# Altium schematic sheet MIPI_CSI.SchDoc: MIPI CSI CAM
size A4; DrawnBy: ThanhQuoc; Revision: V01; SheetNumber: 17; SheetTotal: 21; Project: RV1126 CAMERA BOARD DESIGN
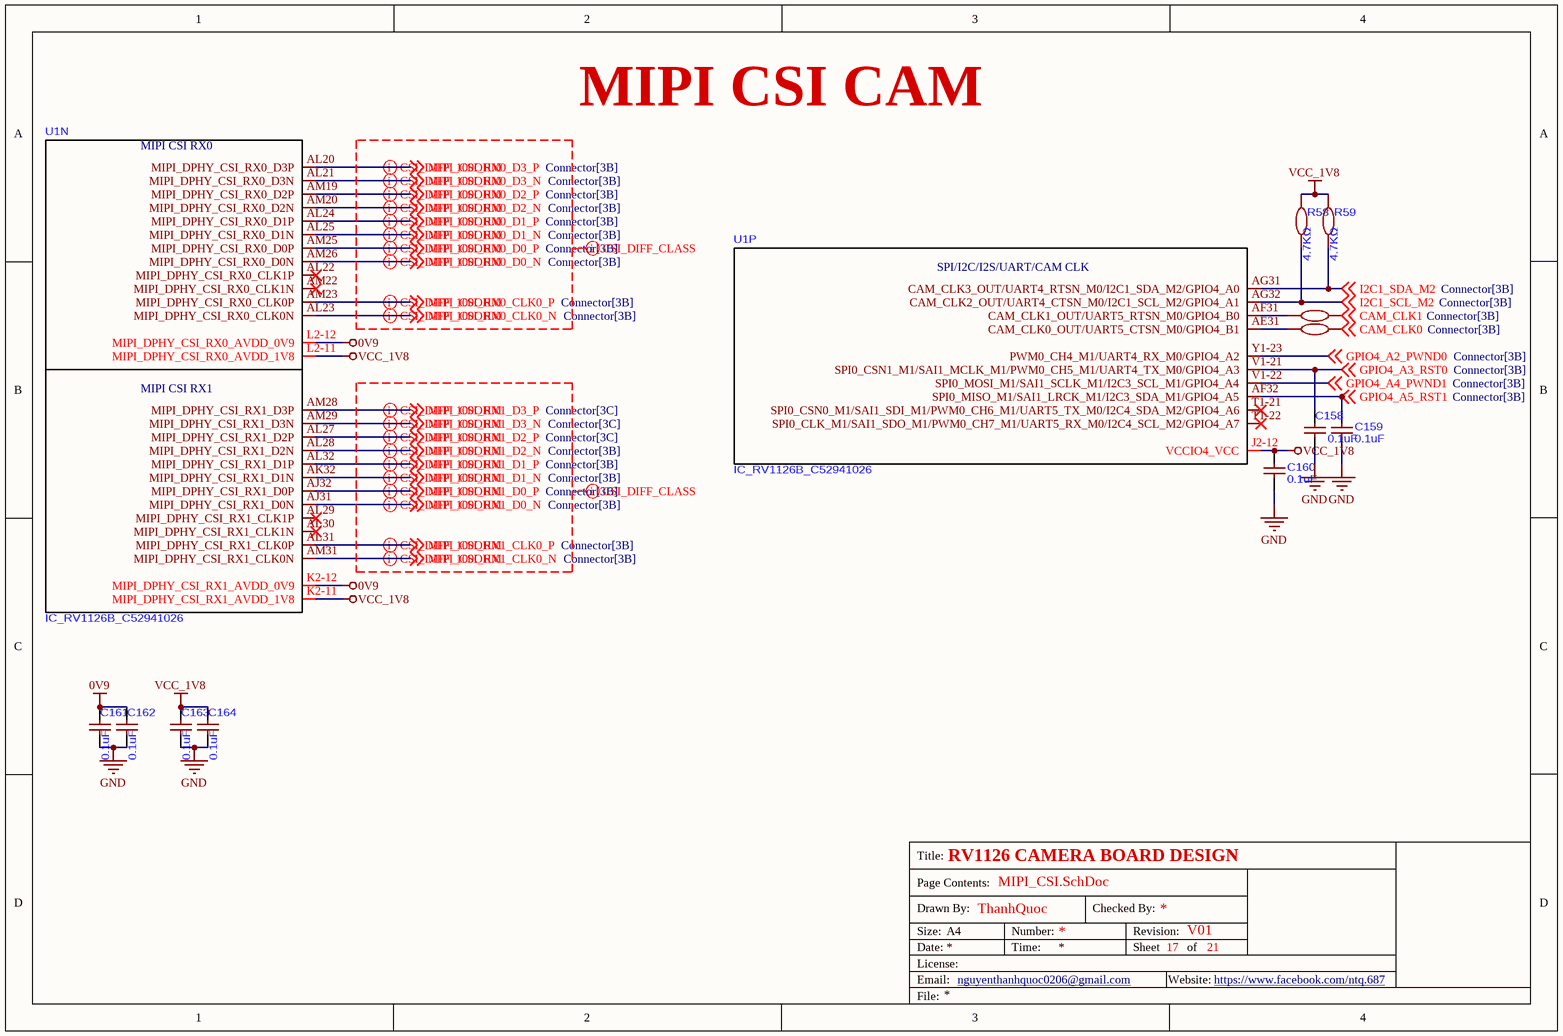
[diagram p0: MIPI_CSI.SchDoc]

## Parts
C158  0.1uF  [C0201]
C159  0.1uF  [C0201]
C160  0.1uF  [C0201]
C161  0.1uF  [C0201]
C162  0.1uF  [C0201]
C163  0.1uF  [C0201]
C164  0.1uF  [C0201]
R58  4.7KΩ  [R0201]
R59  4.7KΩ  [R0201]
R60  22Ω  [R0201]  (value not drawn)
R61  22Ω  [R0201]  (value not drawn)
U1  IC_RV1126B_C52941026  [CCSP-491_L14.0-W14.0-TL_RV1126B]  (parts N,P of 18)

## Nets
0V9: C161.2 C162.2 U1.K2-12(MIPI_DPHY_CSI_RX1_AVDD_0V9) U1.L2-12(MIPI_DPHY_CSI_RX0_AVDD_0V9)
GND: C158.1 C159.1 C160.1 C161.1 C162.1 C163.1 C164.1
VCC_1V8: C160.2 C163.2 C164.2 R58.2 R59.2 U1.J2-12(VCCIO4_VCC) U1.K2-11(MIPI_DPHY_CSI_RX1_AVDD_1V8) U1.L2-11(MIPI_DPHY_CSI_RX0_AVDD_1V8)
CAM_CLK0: R61.2 ; off-sheet CAM_CLK0
CAM_CLK1: R60.2 ; off-sheet CAM_CLK1
GPIO4_A2_PWND0: U1.Y1-23(PWM0_CH4_M1/UART4_RX_M0/GPIO4_A2) ; off-sheet GPIO4_A2_PWND0
GPIO4_A3_RST0: C158.2 U1.V1-21(SPI0_CSN1_M1/SAI1_MCLK_M1/PWM0_CH5_M1/UART4_TX_M0/GPIO4_A3) ; off-sheet GPIO4_A3_RST0
GPIO4_A4_PWND1: U1.V1-22(SPI0_MOSI_M1/SAI1_SCLK_M1/I2C3_SCL_M1/GPIO4_A4) ; off-sheet GPIO4_A4_PWND1
GPIO4_A5_RST1: C159.2 U1.AF32(SPI0_MISO_M1/SAI1_LRCK_M1/I2C3_SDA_M1/GPIO4_A5) ; off-sheet GPIO4_A5_RST1
I2C1_SCL_M2: R58.1 U1.AG32(CAM_CLK2_OUT/UART4_CTSN_M0/I2C1_SCL_M2/GPIO4_A1) ; off-sheet I2C1_SCL_M2
I2C1_SDA_M2: R59.1 U1.AG31(CAM_CLK3_OUT/UART4_RTSN_M0/I2C1_SDA_M2/GPIO4_A0) ; off-sheet I2C1_SDA_M2
MIPI_CSI_RX0_CLK0_N: U1.AL23(MIPI_DPHY_CSI_RX0_CLK0N) ; off-sheet MIPI_CSI_RX0_CLK0_N
MIPI_CSI_RX0_CLK0_P: U1.AM23(MIPI_DPHY_CSI_RX0_CLK0P) ; off-sheet MIPI_CSI_RX0_CLK0_P
MIPI_CSI_RX0_D0_N: U1.AM26(MIPI_DPHY_CSI_RX0_D0N) ; off-sheet MIPI_CSI_RX0_D0_N
MIPI_CSI_RX0_D0_P: U1.AM25(MIPI_DPHY_CSI_RX0_D0P) ; off-sheet MIPI_CSI_RX0_D0_P
MIPI_CSI_RX0_D1_N: U1.AL25(MIPI_DPHY_CSI_RX0_D1N) ; off-sheet MIPI_CSI_RX0_D1_N
MIPI_CSI_RX0_D1_P: U1.AL24(MIPI_DPHY_CSI_RX0_D1P) ; off-sheet MIPI_CSI_RX0_D1_P
MIPI_CSI_RX0_D2_N: U1.AM20(MIPI_DPHY_CSI_RX0_D2N) ; off-sheet MIPI_CSI_RX0_D2_N
MIPI_CSI_RX0_D2_P: U1.AM19(MIPI_DPHY_CSI_RX0_D2P) ; off-sheet MIPI_CSI_RX0_D2_P
MIPI_CSI_RX0_D3_N: U1.AL21(MIPI_DPHY_CSI_RX0_D3N) ; off-sheet MIPI_CSI_RX0_D3_N
MIPI_CSI_RX0_D3_P: U1.AL20(MIPI_DPHY_CSI_RX0_D3P) ; off-sheet MIPI_CSI_RX0_D3_P
MIPI_CSI_RX1_CLK0_N: U1.AM31(MIPI_DPHY_CSI_RX1_CLK0N) ; off-sheet MIPI_CSI_RX1_CLK0_N
MIPI_CSI_RX1_CLK0_P: U1.AL31(MIPI_DPHY_CSI_RX1_CLK0P) ; off-sheet MIPI_CSI_RX1_CLK0_P
MIPI_CSI_RX1_D0_N: U1.AJ31(MIPI_DPHY_CSI_RX1_D0N) ; off-sheet MIPI_CSI_RX1_D0_N
MIPI_CSI_RX1_D0_P: U1.AJ32(MIPI_DPHY_CSI_RX1_D0P) ; off-sheet MIPI_CSI_RX1_D0_P
MIPI_CSI_RX1_D1_N: U1.AK32(MIPI_DPHY_CSI_RX1_D1N) ; off-sheet MIPI_CSI_RX1_D1_N
MIPI_CSI_RX1_D1_P: U1.AL32(MIPI_DPHY_CSI_RX1_D1P) ; off-sheet MIPI_CSI_RX1_D1_P
MIPI_CSI_RX1_D2_N: U1.AL28(MIPI_DPHY_CSI_RX1_D2N) ; off-sheet MIPI_CSI_RX1_D2_N
MIPI_CSI_RX1_D2_P: U1.AL27(MIPI_DPHY_CSI_RX1_D2P) ; off-sheet MIPI_CSI_RX1_D2_P
MIPI_CSI_RX1_D3_N: U1.AM29(MIPI_DPHY_CSI_RX1_D3N) ; off-sheet MIPI_CSI_RX1_D3_N
MIPI_CSI_RX1_D3_P: U1.AM28(MIPI_DPHY_CSI_RX1_D3P) ; off-sheet MIPI_CSI_RX1_D3_P
NetR60_1: R60.1 U1.AF31(CAM_CLK1_OUT/UART5_RTSN_M0/GPIO4_B0)
NetR61_1: R61.1 U1.AE31(CAM_CLK0_OUT/UART5_CTSN_M0/GPIO4_B1)

Not connected (* = marked no-connect by the designer): U1 AL22(MIPI_DPHY_CSI_RX0_CLK1P)* AL29(MIPI_DPHY_CSI_RX1_CLK1P)* AL30(MIPI_DPHY_CSI_RX1_CLK1N)* AM22(MIPI_DPHY_CSI_RX0_CLK1N)* T1-21(SPI0_CSN0_M1/SAI1_SDI_M1/PWM0_CH6_M1/UART5_TX_M0/I2C4_SDA_M2/GPIO4_A6)* T1-22(SPI0_CLK_M1/SAI1_SDO_M1/PWM0_CH7_M1/UART5_RX_M0/I2C4_SCL_M2/GPIO4_A7)*

## Layout directives
differential pair; differential pair class CSI_DIFF_100OHM: MIPI_CSI_RX0_CLK0_N, MIPI_CSI_RX0_CLK0_P, MIPI_CSI_RX0_D0_N, MIPI_CSI_RX0_D0_P, MIPI_CSI_RX0_D1_N, MIPI_CSI_RX0_D1_P, MIPI_CSI_RX0_D2_N, MIPI_CSI_RX0_D2_P, MIPI_CSI_RX0_D3_N, MIPI_CSI_RX0_D3_P, MIPI_CSI_RX1_CLK0_N, MIPI_CSI_RX1_CLK0_P, MIPI_CSI_RX1_D0_N, MIPI_CSI_RX1_D0_P, MIPI_CSI_RX1_D1_N, MIPI_CSI_RX1_D1_P, MIPI_CSI_RX1_D2_N, MIPI_CSI_RX1_D2_P, MIPI_CSI_RX1_D3_N, MIPI_CSI_RX1_D3_P
net class CSI_DIFF_CLASS: MIPI_CSI_RX0_CLK0_N, MIPI_CSI_RX0_CLK0_P, MIPI_CSI_RX0_D0_N, MIPI_CSI_RX0_D0_P, MIPI_CSI_RX0_D1_N, MIPI_CSI_RX0_D1_P, MIPI_CSI_RX0_D2_N, MIPI_CSI_RX0_D2_P, MIPI_CSI_RX0_D3_N, MIPI_CSI_RX0_D3_P, MIPI_CSI_RX1_CLK0_N, MIPI_CSI_RX1_CLK0_P, MIPI_CSI_RX1_D0_N, MIPI_CSI_RX1_D0_P, MIPI_CSI_RX1_D1_N, MIPI_CSI_RX1_D1_P, MIPI_CSI_RX1_D2_N, MIPI_CSI_RX1_D2_P, MIPI_CSI_RX1_D3_N, MIPI_CSI_RX1_D3_P

## Notes on the sheet
- Title:
- Drawn By:
- Page Contents:
- Checked By:
- Size:
- Date:
- File:
- License:
- Email:
- A4
- nguyenthanhquoc0206@gmail.com
- Number:
- Time:
- Revision:
- Sheet
- Website:
- of
- https://www.facebook.com/ntq.687
- (in symbol IC_RV1126B_C52941026, part N) MIPI CSI RX0; MIPI CSI RX1
- (in symbol IC_RV1126B_C52941026, part P) SPI/I2C/I2S/UART/CAM CLK

## Library data of the parts
C158-C164 = CAP_100nF-6.3V-10%-0201_1: 0.1uF ±10% 6.3V Ceramic Capacitor X5R 0201
R58 R59 = RES_4.7K-50mW-1%-0201: RES 4.7kΩ ±1% 50mW 0201; ComponentLink1Description: LCSC; ComponentLink1URL: https://www.lcsc.com/product-detail/C295718.html?s_z=n_q_t_120%2520OHM&spm=wm.fly.bg.5.xh___wm.ssy.tc.1.tz&lcsc_vid=EwRWBFZSQVIPVFdUTlJfVldeFFRYUFQAElRYBFRRE1MxVlNeRFZeU1BfTlBYVzsOAxUeFF5JWBYZEEoKFBINSQcJGk4eFQsCAgIaSgADAwAHC0slRVhcV1ZTT08GEwkK
R60 R61 = RES_22-50mW-1%-0201: RES 22Ω ±1% 50mW 0201; ComponentLink1Description: LCSC; ComponentLink1URL: https://www.lcsc.com/product-detail/C295718.html?s_z=n_q_t_120%2520OHM&spm=wm.fly.bg.5.xh___wm.ssy.tc.1.tz&lcsc_vid=EwRWBFZSQVIPVFdUTlJfVldeFFRYUFQAElRYBFRRE1MxVlNeRFZeU1BfTlBYVzsOAxUeFF5JWBYZEEoKFBINSQcJGk4eFQsCAgIaSgADAwAHC0slRVhcV1ZTT08GEwkK